# Altium schematic sheet LED_Display.SchDoc
size A4; Organization: ENEL429 Group N; Address1: ECE Department; Address2: University of Canterbury; Address3: Christchurch 8041; Address4: New Zealand; Revision: 1
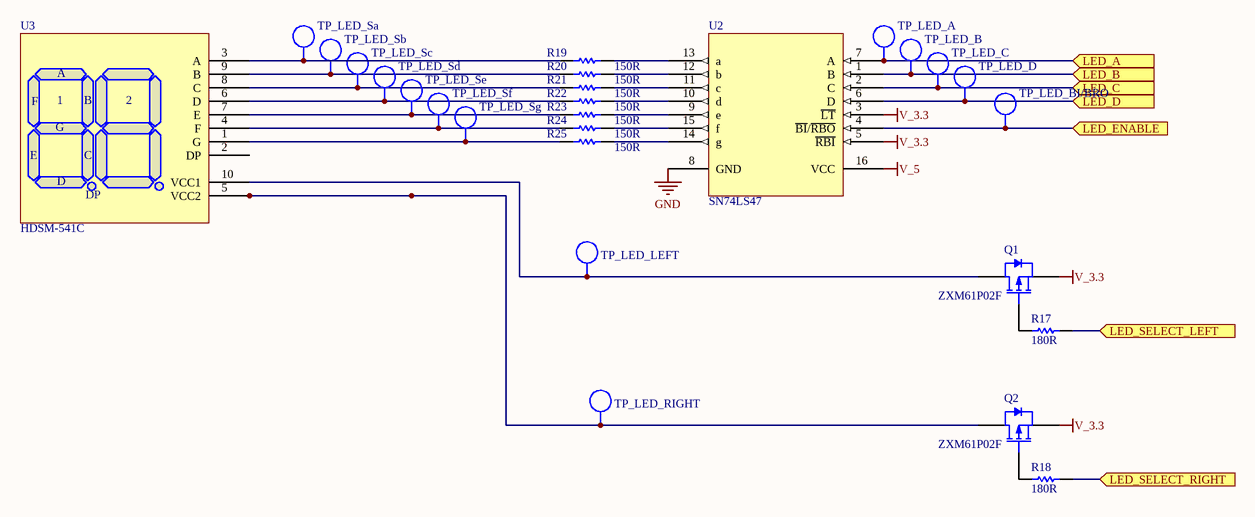
[diagram p0: LED_Display.SchDoc]

## Parts
Q1  ZXM61P02F  [SOT23]
Q2  ZXM61P02F  [SOT23]
R17  180R  [0603]
R18  180R  [0603]
R19  150R  [0603]
R20  150R  [0603]
R21  150R  [0603]
R22  150R  [0603]
R23  150R  [0603]
R24  150R  [0603]
R25  150R  [0603]
TP_LED_A  TP  [TEST_POINT_4X2MM]  (value not drawn)  (no BOM)
TP_LED_B  TP  [TEST_POINT_4X2MM]  (value not drawn)  (no BOM)
TP_LED_BI/BRO  TP  [TEST_POINT_4X2MM]  (value not drawn)  (no BOM)
TP_LED_C  TP  [TEST_POINT_4X2MM]  (value not drawn)  (no BOM)
TP_LED_D  TP  [TEST_POINT_4X2MM]  (value not drawn)  (no BOM)
TP_LED_LEFT  TP  [TEST_POINT_4X2MM]  (value not drawn)  (no BOM)
TP_LED_RIGHT  TP  [TEST_POINT_4X2MM]  (value not drawn)  (no BOM)
TP_LED_Sa  TP  [TEST_POINT_4X2MM]  (value not drawn)  (no BOM)
TP_LED_Sb  TP  [TEST_POINT_4X2MM]  (value not drawn)  (no BOM)
TP_LED_Sc  TP  [TEST_POINT_4X2MM]  (value not drawn)  (no BOM)
TP_LED_Sd  TP  [TEST_POINT_4X2MM]  (value not drawn)  (no BOM)
TP_LED_Se  TP  [TEST_POINT_4X2MM]  (value not drawn)  (no BOM)
TP_LED_Sf  TP  [TEST_POINT_4X2MM]  (value not drawn)  (no BOM)
TP_LED_Sg  TP  [TEST_POINT_4X2MM]  (value not drawn)  (no BOM)
U2  SN74LS47  [SOP127P780X200-16N]
U3  HDSM-541C  [HDSM-541C]

## Ports
LED_A (in), LED_B (in), LED_C (in), LED_D (in), LED_ENABLE (in), LED_SELECT_LEFT (in), LED_SELECT_RIGHT (in)

## Nets
GND: U2.8(GND)
V_3.3: Q1.2(S) Q2.2(S) U2.3(~{LT}) U2.5(~{RBI})
V_5: U2.16(VCC)
LED_A: TP_LED_A.1 U2.7(A) ; port LED_A
LED_B: TP_LED_B.1 U2.1(B) ; port LED_B
LED_C: TP_LED_C.1 U2.2(C) ; port LED_C
LED_D: TP_LED_D.1 U2.6(D) ; port LED_D
LED_ENABLE: TP_LED_BI/BRO.1 U2.4(~{BI}/~{RBO}) ; port LED_ENABLE
LED_SELECT_LEFT: R17.2 ; port LED_SELECT_LEFT
LED_SELECT_RIGHT: R18.2 ; port LED_SELECT_RIGHT
NetQ1_1: Q1.1(G) R17.1
NetQ1_3: Q1.3(D) TP_LED_LEFT.1 U3.10(VCC1)
NetQ2_1: Q2.1(G) R18.1
NetQ2_3: Q2.3(D) TP_LED_RIGHT.1 U3.5(VCC2)
NetR19_1: R19.1 TP_LED_Sa.1 U3.3(A)
NetR19_2: R19.2 U2.13(a)
NetR20_1: R20.1 TP_LED_Sb.1 U3.9(B)
NetR20_2: R20.2 U2.12(b)
NetR21_1: R21.1 TP_LED_Sc.1 U3.8(C)
NetR21_2: R21.2 U2.11(c)
NetR22_1: R22.1 TP_LED_Sd.1 U3.6(D)
NetR22_2: R22.2 U2.10(d)
NetR23_1: R23.1 TP_LED_Se.1 U3.7(E)
NetR23_2: R23.2 U2.9(e)
NetR24_1: R24.1 TP_LED_Sf.1 U3.4(F)
NetR24_2: R24.2 U2.15(f)
NetR25_1: R25.1 TP_LED_Sg.1 U3.1(G)
NetR25_2: R25.2 U2.14(g)

Not connected (* = marked no-connect by the designer): U3 2(DP)

## Notes on the sheet
- Title
- Drawn by:
- Date:
- Time:
- Revision:
- Sheet
- of
- File:

## Library data of the parts
Q1 Q2 = TF_ZXM61P02F: 20V P-channel enhancement mode MOSFET; Manufacturer: Zetex; Supplier 1: Element 14; Supplier Part Number 1: 9525297; price: 1.31; Supplier 2: Digi-Key; Supplier Part Number 2: ZXM61P02FCT-ND; value: ZXM61P02F; Part Number: TF_ZXM61P02F; Component Kind: Standard; Component Type: Standard; Designator: TF_ZXM61P02F; Pin Count: 3; PCB3D: sot23
R17 R18 = RS_180R 0603: RES 180OHM 1/10W 1% 0603 SMD; Manufacturer: Panasonic - ECG; Manufacturer PN: ERJ-3EKF1800V; LatestRevisionDate: 25 June 2009; Supplier 1: Digi-Key; Supplier Part Number 1: P180HTR-ND; Value: 180R; Part Number: RS_180R 0603; Component Kind: Standard; Component Type: Standard; Designator: RS_180R 0603; Pin Count: 2; Signal Integrity: Res; Simulation: RESISTOR
R19-R25 = RS_150R 0603: RES 150 OHM 1/10W 1% 0603 SMD; Manufacturer: ROHM; Manufacturer PN: MCR03EZPFX1500; LatestRevisionDate: 4th July 08; Supplier 1: Digi-Key; Supplier Part Number 1: RHM150HTR-ND; Value: 150R; Part Number: RS_150R 0603; Component Kind: Standard; Component Type: Standard; Designator: RS_150R 0603; Pin Count: 2; Signal Integrity: Res; Simulation: RESISTOR
TP_LED_A TP_LED_B TP_LED_BI/BRO TP_LED_C TP_LED_D TP_LED_LEFT TP_LED_RIGHT TP_LED_Sa TP_LED_Sb TP_LED_Sc TP_LED_Sd TP_LED_Se TP_LED_Sf TP_LED_Sg = TP_TESTPOINT: Test-Point; LatestRevisionDate: 29 May 08; Manufacturer PN: *; Manufacturer: *; Supplier 1: Digi-Key; Supplier Part Number 1: 5016KTR-ND; Value: TP; Part Number: TP_TESTPOINT; Component Type: Standard (No BOM); Designator: TP_TESTPOINT; Pin Count: 1
U2 = SN74LS47: Manufacturer: Texas Instruments; Manufacturer PN: SN74LS47NSR; Supplier 1: Digikey; Supplier Part Number 1: 296-13223-1-ND
U3 = HDSM-541C: 2 character 7 segment display; Manufacturer: AVAGO TECHNOLOGIES; Manufacturer PN: HDSM-541C; Supplier 1: Digikey; Supplier Part Number 1: 516-2248-1-ND